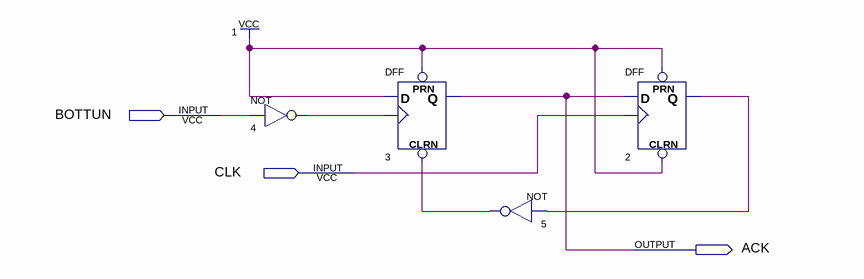
[diagram p0: schematic sheet]
// Quartus schematic waveform3.bdf as structural Verilog: 4 symbols, 3 pins
module waveform3 (
  input  BOTTUN,
  input  CLK,
  output ACK
);

  wire n2_q, n4_out, n5_out;

  not u_4 (n4_out, BOTTUN);
  DFF u_3 (.CLRN(n5_out), .CLK(n4_out), .D(1'b1), .PRN(1'b1), .Q(ACK));
  not u_5 (n5_out, n2_q);
  DFF u_2 (.CLRN(1'b1), .CLK(CLK), .D(ACK), .PRN(1'b1), .Q(n2_q));
endmodule
